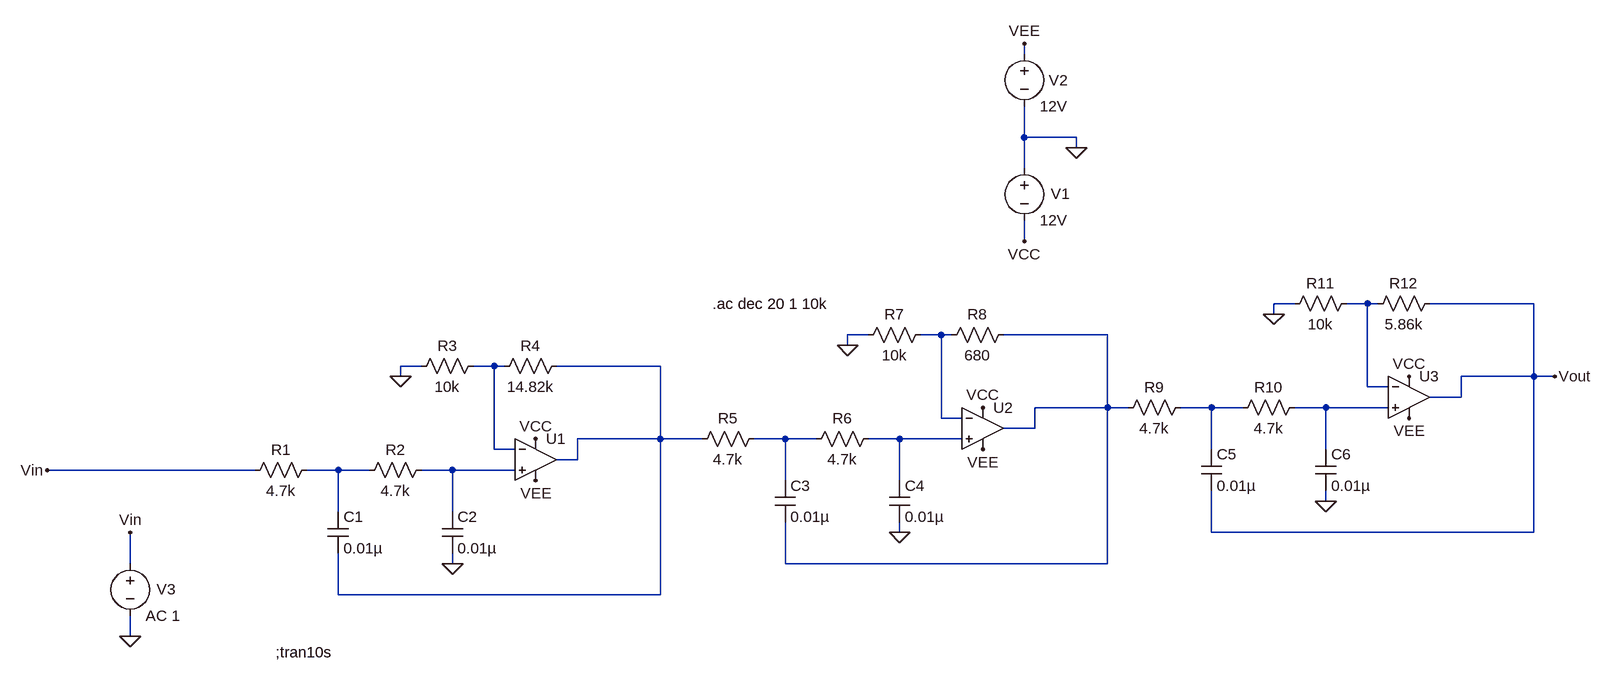
[diagram p0: schematic Design_Challenge - 6th Order.asc]
Design_Challenge - 6th Order.asc, the LTspice schematic file:
Version 4
SHEET 1 3956 1680
WIRE -256 -176 -256 -192
WIRE -256 -48 -256 -96
WIRE -176 -48 -256 -48
WIRE -176 -32 -176 -48
WIRE -256 0 -256 -48
WIRE -256 112 -256 80
WIRE 160 208 128 208
WIRE 272 208 240 208
WIRE 288 208 272 208
WIRE 528 208 368 208
WIRE 128 224 128 208
WIRE -496 256 -528 256
WIRE -384 256 -416 256
WIRE -368 256 -384 256
WIRE -128 256 -288 256
WIRE -528 272 -528 256
WIRE -1184 304 -1216 304
WIRE -1072 304 -1104 304
WIRE -1056 304 -1072 304
WIRE -816 304 -976 304
WIRE -1216 320 -1216 304
WIRE 528 320 528 208
WIRE 528 320 416 320
WIRE 560 320 528 320
WIRE 272 336 272 208
WIRE 304 336 272 336
WIRE 416 352 416 320
WIRE 416 352 368 352
WIRE -128 368 -128 256
WIRE -128 368 -240 368
WIRE -96 368 -128 368
WIRE 32 368 -16 368
WIRE 80 368 32 368
WIRE 208 368 160 368
WIRE 304 368 208 368
WIRE -384 384 -384 256
WIRE -352 384 -384 384
WIRE -240 400 -240 368
WIRE -240 400 -288 400
WIRE -816 416 -816 304
WIRE -816 416 -944 416
WIRE -752 416 -816 416
WIRE -624 416 -672 416
WIRE -576 416 -624 416
WIRE -448 416 -496 416
WIRE -352 416 -448 416
WIRE -1072 432 -1072 304
WIRE -1040 432 -1072 432
WIRE 32 432 32 368
WIRE 208 432 208 368
WIRE -944 448 -944 416
WIRE -944 448 -976 448
WIRE -1440 464 -1760 464
WIRE -1312 464 -1360 464
WIRE -1264 464 -1312 464
WIRE -1136 464 -1184 464
WIRE -1040 464 -1136 464
WIRE -624 480 -624 416
WIRE -448 480 -448 416
WIRE 208 512 208 496
WIRE -1312 528 -1312 464
WIRE -1136 528 -1136 464
WIRE -448 560 -448 544
WIRE 32 560 32 496
WIRE 528 560 528 320
WIRE 528 560 32 560
WIRE -1632 608 -1632 560
WIRE -1136 608 -1136 592
WIRE -624 608 -624 544
WIRE -128 608 -128 368
WIRE -128 608 -624 608
WIRE -1312 656 -1312 592
WIRE -816 656 -816 416
WIRE -816 656 -1312 656
WIRE -1632 720 -1632 688
FLAG -176 -32 0
FLAG -256 -192 VEE
FLAG -1008 480 VEE
FLAG -256 112 VCC
FLAG -1008 416 VCC
FLAG -1760 464 Vin
FLAG -1216 320 0
FLAG -1136 608 0
FLAG -320 432 VEE
FLAG -320 368 VCC
FLAG -528 272 0
FLAG -448 560 0
FLAG -1632 720 0
FLAG -1632 560 Vin
FLAG 560 320 Vout
FLAG 336 384 VEE
FLAG 336 320 VCC
FLAG 128 224 0
FLAG 208 512 0
SYMBOL voltage -256 -192 R0
WINDOW 0 38 56 Left 2
SYMATTR InstName V2
SYMATTR Value 12V
SYMBOL voltage -256 -16 R0
WINDOW 0 41 55 Left 2
SYMATTR InstName V1
SYMATTR Value 12V
SYMBOL res -1344 448 R90
WINDOW 0 0 56 VBottom 2
WINDOW 3 32 56 VTop 2
SYMATTR InstName R1
SYMATTR Value 4.7k
SYMBOL res -1168 448 R90
WINDOW 0 0 56 VBottom 2
WINDOW 3 32 56 VTop 2
SYMATTR InstName R2
SYMATTR Value 4.7k
SYMBOL res -1088 288 R90
WINDOW 0 0 56 VBottom 2
WINDOW 3 32 56 VTop 2
SYMATTR InstName R3
SYMATTR Value 10k
SYMBOL res -960 288 R90
WINDOW 0 0 56 VBottom 2
WINDOW 3 32 56 VTop 2
SYMATTR InstName R4
SYMATTR Value 14.82k
SYMBOL cap -1328 528 R0
SYMATTR InstName C1
SYMATTR Value 0.01µ
SYMBOL cap -1152 528 R0
SYMATTR InstName C2
SYMATTR Value 0.01µ
SYMBOL res -656 400 R90
WINDOW 0 0 56 VBottom 2
WINDOW 3 32 56 VTop 2
SYMATTR InstName R5
SYMATTR Value 4.7k
SYMBOL res -480 400 R90
WINDOW 0 0 56 VBottom 2
WINDOW 3 32 56 VTop 2
SYMATTR InstName R6
SYMATTR Value 4.7k
SYMBOL res -400 240 R90
WINDOW 0 0 56 VBottom 2
WINDOW 3 32 56 VTop 2
SYMATTR InstName R7
SYMATTR Value 10k
SYMBOL res -272 240 R90
WINDOW 0 0 56 VBottom 2
WINDOW 3 32 56 VTop 2
SYMATTR InstName R8
SYMATTR Value 680
SYMBOL cap -640 480 R0
SYMATTR InstName C3
SYMATTR Value 0.01µ
SYMBOL cap -464 480 R0
SYMATTR InstName C4
SYMATTR Value 0.01µ
SYMBOL voltage -1632 592 R0
WINDOW 0 41 55 Left 2
SYMATTR InstName V3
SYMATTR Value AC 1
SYMBOL OpAmps\\UniversalOpamp -1008 448 R0
SYMATTR InstName U1
SYMBOL OpAmps\\UniversalOpamp -320 400 R0
SYMATTR InstName U2
SYMBOL res 0 352 R90
WINDOW 0 0 56 VBottom 2
WINDOW 3 32 56 VTop 2
SYMATTR InstName R9
SYMATTR Value 4.7k
SYMBOL res 176 352 R90
WINDOW 0 0 56 VBottom 2
WINDOW 3 32 56 VTop 2
SYMATTR InstName R10
SYMATTR Value 4.7k
SYMBOL res 256 192 R90
WINDOW 0 0 56 VBottom 2
WINDOW 3 32 56 VTop 2
SYMATTR InstName R11
SYMATTR Value 10k
SYMBOL res 384 192 R90
WINDOW 0 0 56 VBottom 2
WINDOW 3 32 56 VTop 2
SYMATTR InstName R12
SYMATTR Value 5.86k
SYMBOL cap 16 432 R0
SYMATTR InstName C5
SYMATTR Value 0.01µ
SYMBOL cap 192 432 R0
SYMATTR InstName C6
SYMATTR Value 0.01µ
SYMBOL OpAmps\\UniversalOpamp 336 352 R0
SYMATTR InstName U3
TEXT -736 208 Left 2 !.ac dec 20 1 10k
TEXT -1408 744 Left 2 !;tran10s

The netlist it stands for:
* Design_Challenge - 6th Order.asc
V2 VEE 0 12V
V1 0 VCC 12V
R1 N010 Vin 4.7k
R2 N011 N010 4.7k
R3 N004 0 10k
R4 N005 N004 14.82k
C1 N010 N005 0.01µ
C2 N011 0 0.01µ
R5 N008 N005 4.7k
R6 N009 N008 4.7k
R7 N002 0 10k
R8 N003 N002 680
C3 N008 N003 0.01µ
C4 N009 0 0.01µ
V3 Vin 0 AC 1
XU1 N011 N004 VCC VEE N005 level1 Avol=1Meg GBW=10Meg Vos=0 En=0 Enk=0 In=0 Ink=0 Rin=500Meg  ; pins In+ In- V+ V- OUT
XU2 N009 N002 VCC VEE N003 level1 Avol=1Meg GBW=10Meg Vos=0 En=0 Enk=0 In=0 Ink=0 Rin=500Meg  ; pins In+ In- V+ V- OUT
R9 N006 N003 4.7k
R10 N007 N006 4.7k
R11 N001 0 10k
R12 Vout N001 5.86k
C5 N006 Vout 0.01µ
C6 N007 0 0.01µ
XU3 N007 N001 VCC VEE Vout level1 Avol=1Meg GBW=10Meg Vos=0 En=0 Enk=0 In=0 Ink=0 Rin=500Meg  ; pins In+ In- V+ V- OUT
.ac dec 20 1 10k
;tran10s
.lib UniversalOpAmp1.lib
.backanno
.end